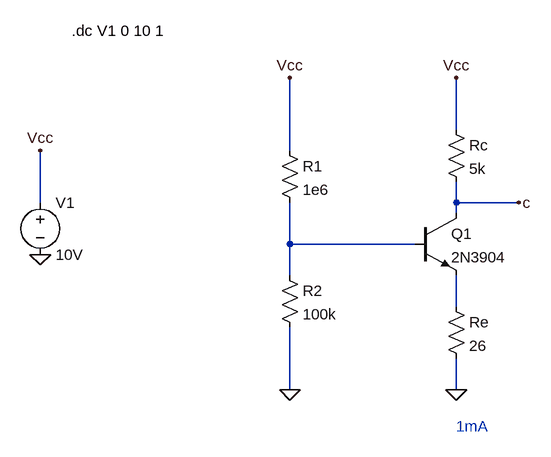
[diagram p0: schematic Mod4.asc]
Mod4.asc, the LTspice schematic file:
Version 4.1
SHEET 1 880 680
WIRE 416 64 416 -16
WIRE 160 96 160 -16
WIRE -224 176 -224 96
WIRE 416 176 416 144
WIRE 512 176 416 176
WIRE 416 192 416 176
WIRE 160 240 160 176
WIRE 352 240 160 240
WIRE 160 288 160 240
WIRE 416 336 416 288
WIRE 160 464 160 368
WIRE 416 464 416 416
FLAG 416 464 0
FLAG 160 464 0
FLAG -224 256 0
FLAG -224 96 Vcc
FLAG 160 -16 Vcc
FLAG 416 -16 Vcc
FLAG 512 176 c
SYMBOL res 144 80 R0
SYMATTR InstName R1
SYMATTR Value 1e6
SYMBOL res 144 272 R0
SYMATTR InstName R2
SYMATTR Value 100k
SYMBOL npn 352 192 R0
SYMATTR InstName Q1
SYMATTR Value 2N3904
SYMBOL res 400 48 R0
SYMATTR InstName Rc
SYMATTR Value 5k
SYMBOL res 400 320 R0
SYMATTR InstName Re
SYMATTR Value 26
SYMBOL voltage -224 160 R0
SYMATTR InstName V1
SYMATTR Value 10V
TEXT 416 520 Left 2 ;1mA
TEXT -176 -88 Left 2 !.dc V1 0 10 1

The netlist it stands for:
* Mod4.asc
R1 Vcc N001 1e6
R2 N001 0 100k
Q1 c N001 N002 0 2N3904
Rc Vcc c 5k
Re N002 0 26
V1 Vcc 0 10V
.model NPN NPN
.model PNP PNP
.lib standard.bjt
* 1mA
.dc V1 0 10 1
.backanno
.end